# Altium schematic sheet Connector_Board.SchDoc
size A4
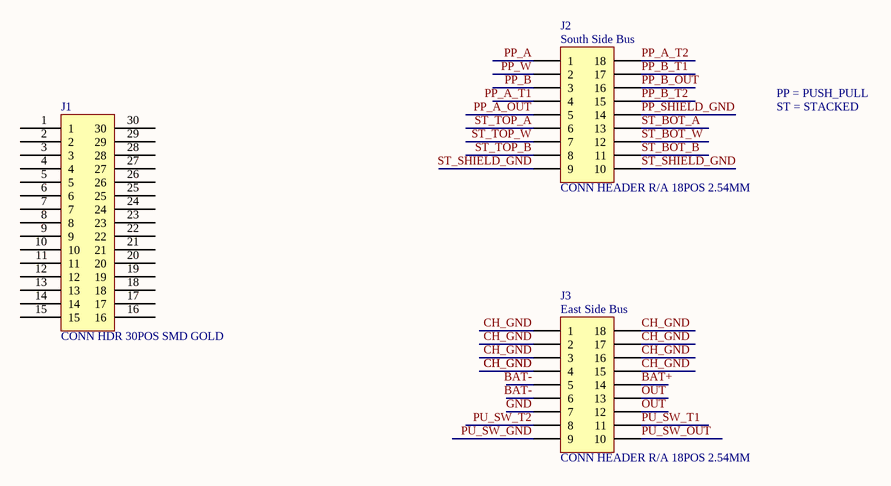
[diagram p0: Connector_Board.SchDoc]

## Parts
J1  CONN HDR 30POS SMD GOLD  [DF12(3.0)-30DP]
J2  CONN HEADER R/A 18POS 2.54MM  [CONN HEADER R/A 18POS 2.54MM]
J3  CONN HEADER R/A 18POS 2.54MM  [CONN HEADER R/A 18POS 2.54MM]

## Nets
BAT+: J3.14
BAT-: J3.5 J3.6
CH_GND: J3.1 J3.2 J3.3 J3.4 J3.15 J3.16 J3.17 J3.18
GND: J3.7
OUT: J3.12 J3.13
PP_A: J2.1
PP_A_OUT: J2.5
PP_A_T1: J2.4
PP_A_T2: J2.18
PP_B: J2.3
PP_B_OUT: J2.16
PP_B_T1: J2.17
PP_B_T2: J2.15
PP_SHIELD_GND: J2.14
PP_W: J2.2
PU_SW_GND: J3.9
PU_SW_OUT: J3.10
PU_SW_T1: J3.11
PU_SW_T2: J3.8
ST_BOT_A: J2.13
ST_BOT_B: J2.11
ST_BOT_W: J2.12
ST_SHIELD_GND: J2.9 J2.10
ST_TOP_A: J2.6
ST_TOP_B: J2.8
ST_TOP_W: J2.7

Not connected (* = marked no-connect by the designer): J1 1 2 3 4 5 6 7 8 9 10 11 12 13 14 15 16 17 18 19 20 21 22 23 24 25 26 27 28 29 30

## Notes on the sheet
- (near J2) South Side Bus
- PP = PUSH_PULL
- ST = STACKED
- (near J3) East Side Bus

## Library data of the parts
J1 = DF12(3.0)-30DP-0.5V(86): 30 Position Connector Header, Outer Shroud Contacts Surface Mount Gold; Manufacturer: Hirose; Digikey Part Number: H11703CT-ND
J2 J3 = CONN HEADER R/A 18POS 2.54MM: Connector Header Through Hole, Right Angle 18 position 0.100" (2.54mm); Manufacturer: Samtec Inc.; Digikey Part Number: SAM1041-09-ND